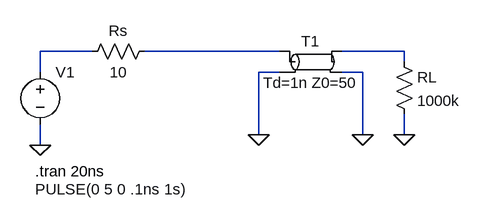
[diagram p0: schematic Tline_open_gradino.asc]
Tline_open_gradino.asc, the LTspice schematic file:
Version 4
SHEET 1 1300 680
WIRE 16 128 -64 128
WIRE 304 128 96 128
WIRE 496 128 400 128
WIRE 496 144 496 128
WIRE -64 160 -64 128
WIRE 304 160 272 160
WIRE 432 160 400 160
WIRE 272 256 272 160
WIRE 432 256 432 160
WIRE 496 256 496 224
WIRE -64 272 -64 240
FLAG -64 272 0
FLAG 272 256 0
FLAG 432 256 0
FLAG 496 256 0
SYMBOL voltage -64 144 R0
WINDOW 123 0 0 Left 0
WINDOW 39 0 0 Left 0
WINDOW 3 -8 196 Left 2
SYMATTR Value PULSE(0 5 0 .1ns 1s)
SYMATTR InstName V1
SYMBOL tline 352 144 R0
SYMATTR InstName T1
SYMATTR Value Td=1n Z0=50
SYMBOL res 112 112 R90
WINDOW 0 0 56 VBottom 2
WINDOW 3 32 56 VTop 2
SYMATTR InstName Rs
SYMATTR Value 10
SYMBOL res 480 128 R0
SYMATTR InstName RL
SYMATTR Value 1000k
TEXT -72 312 Left 2 !.tran 20ns

The netlist it stands for:
* Tline_open_gradino.asc
V1 N001 0 PULSE(0 5 0 .1ns 1s)
T1 N002 0 N003 0 Td=1n Z0=50
Rs N002 N001 10
RL N003 0 1000k
.tran 20ns
.backanno
.end